# Altium schematic sheet Hardwiring.SchDoc
size 594 x 420 mm; Address1: Address1; Address2: Address2; Address3: Address3; Address4: Address4; DocumentNumber: *Э3; SheetNumber: 10; SheetTotal: 11; DocumentType: Схема электрическая *
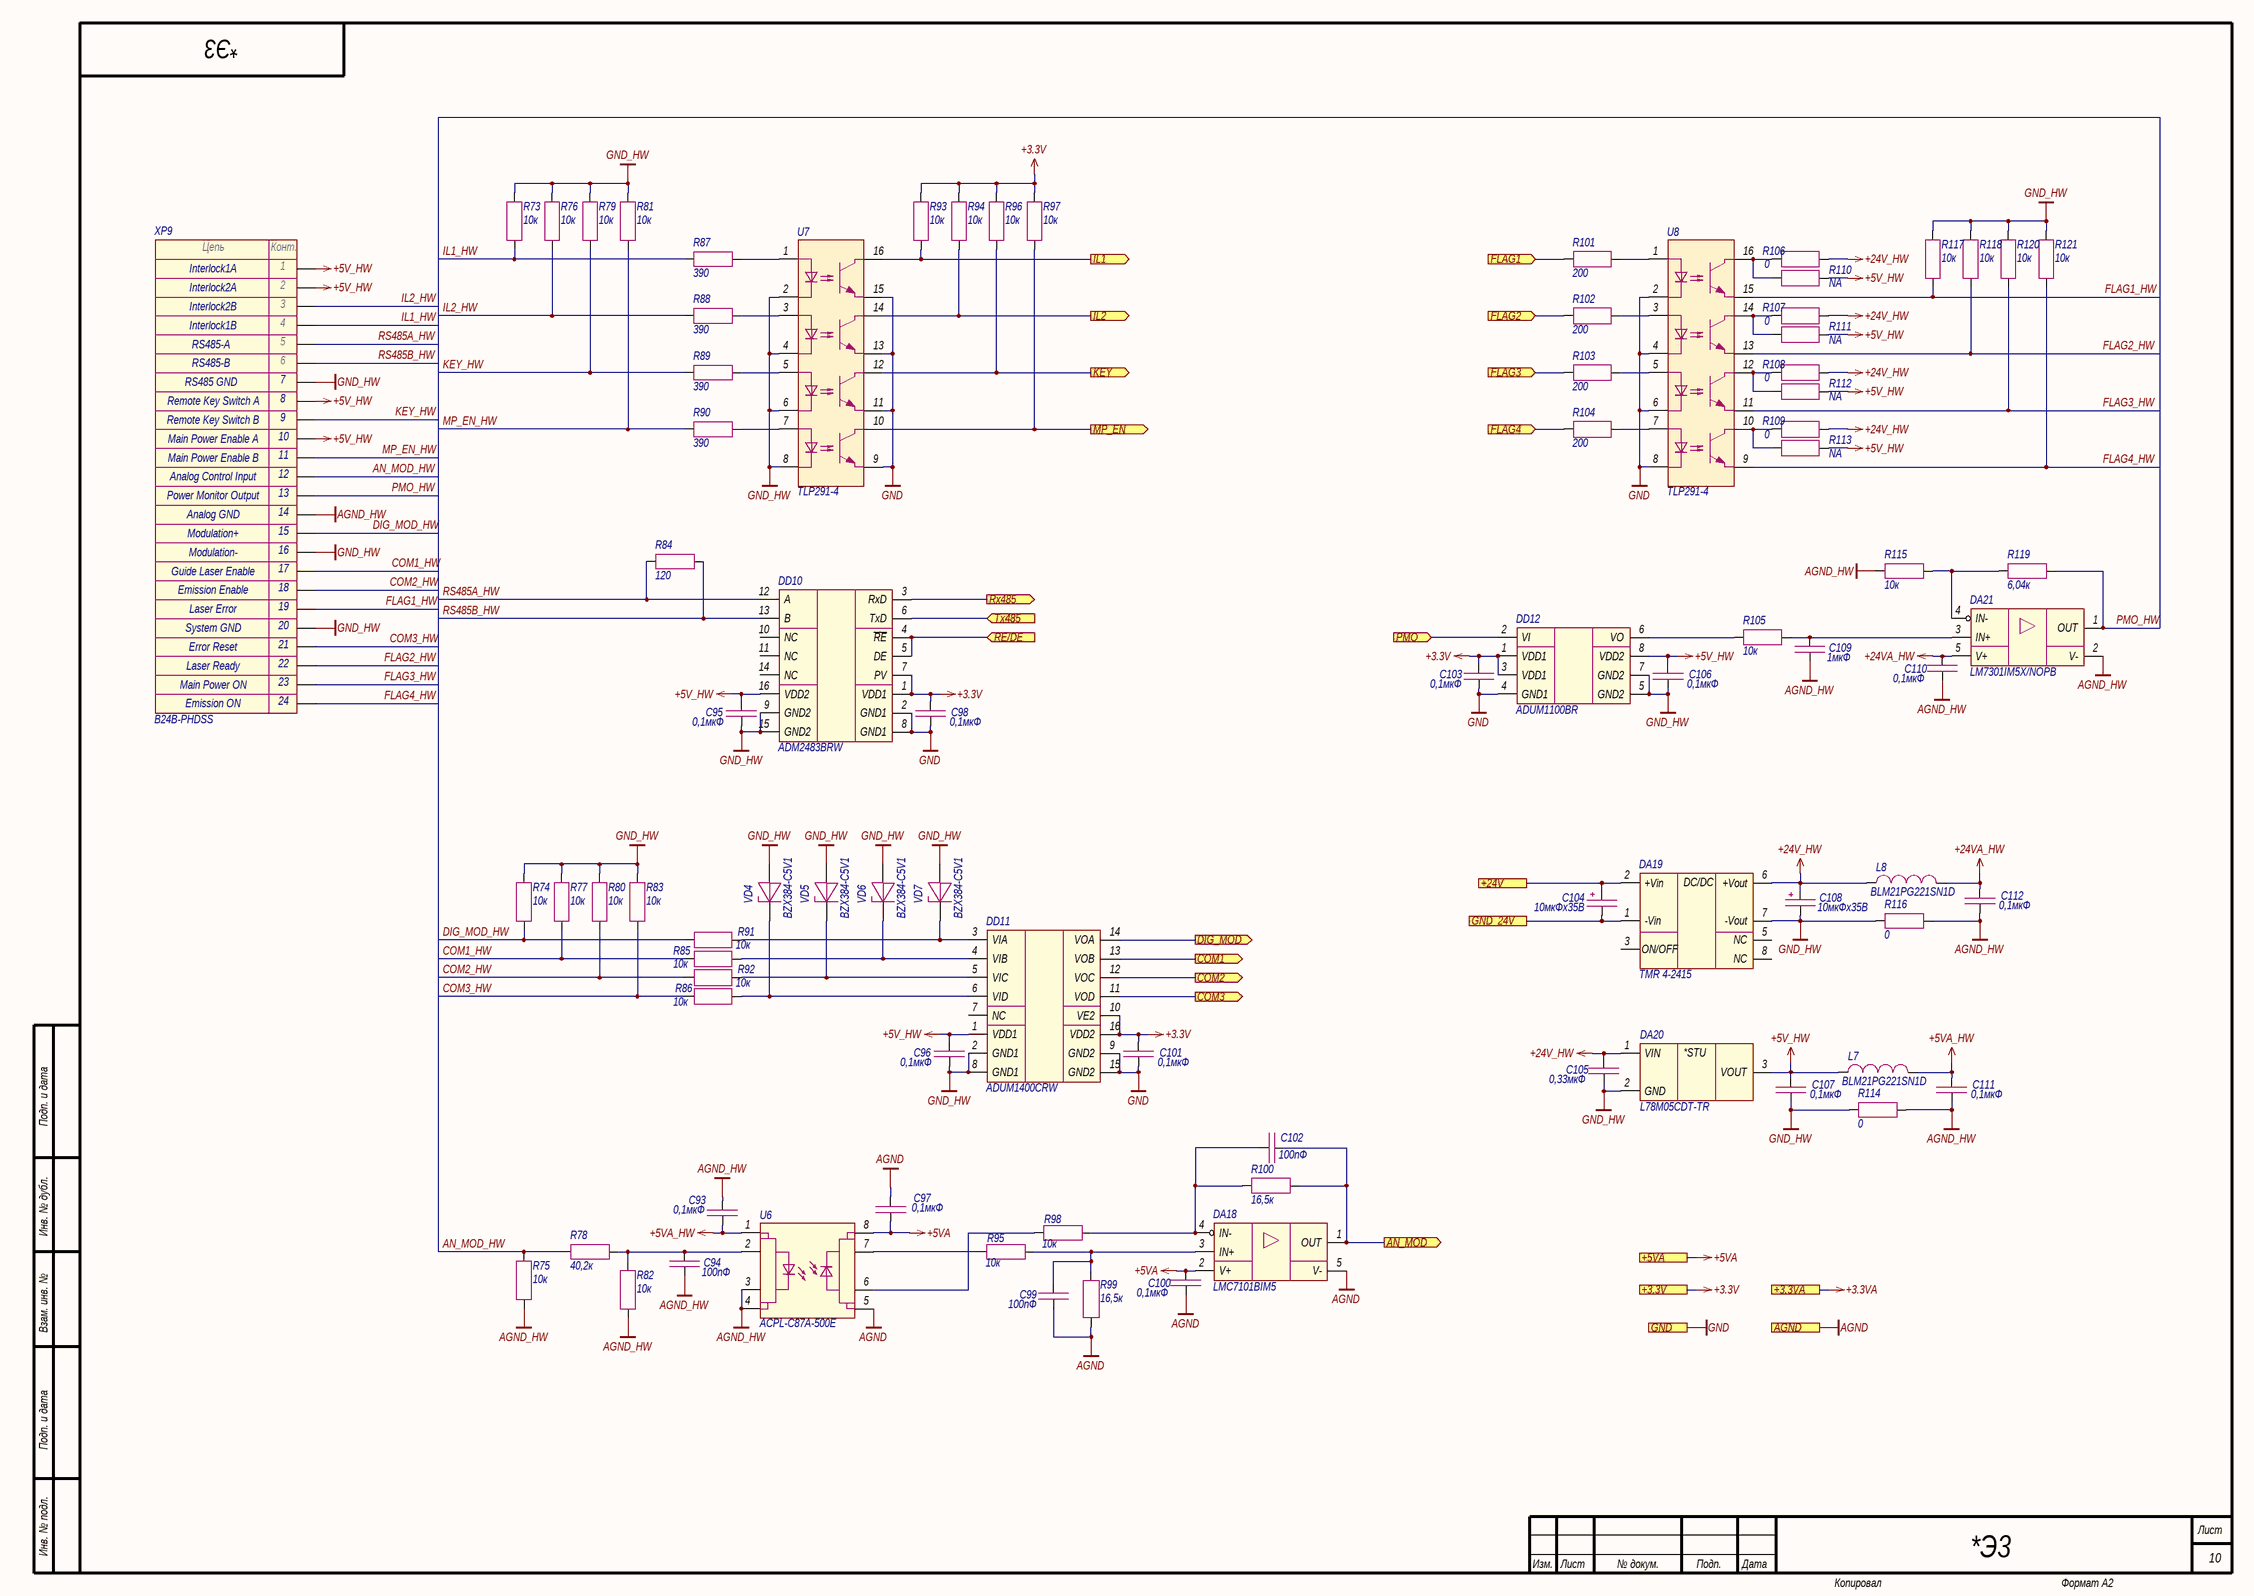
[diagram p0: Hardwiring.SchDoc]

## Parts
C93  0,1мкФ  [CAP_0603]
C94  100пФ  [CAP_0603]
C95  0,1мкФ  [CAP_0603]
C96  0,1мкФ  [CAP_0603]
C97  0,1мкФ  [CAP_0603]
C98  0,1мкФ  [CAP_0603]
C99  100пФ  [CAP_0603]
C100  0,1мкФ  [CAP_0603]
C101  0,1мкФ  [CAP_0603]
C102  100пФ  [CAP_0603]
C103  0,1мкФ  [CAP_0603]
C104  10мкФх35B  [CAP_C]
C105  0,33мкФ  [CAP_0805]
C106  0,1мкФ  [CAP_0603]
C107  0,1мкФ  [CAP_0603]
C108  10мкФх35B  [CAP_C]
C109  1мкФ  [CAP_0603]
C110  0,1мкФ  [CAP_0603]
C111  0,1мкФ  [CAP_0603]
C112  0,1мкФ  [CAP_0603]
DA18  LMC7101BIM5  [SOT-23-5]
DA19  TMR 4-2415  [TMR4 (SIP-8)]
DA20  L78M05CDT-TR  [TO-252]
DA21  LM7301IM5X/NOPB  [SOT-23-5]
DD10  ADM2483BRW  [SOIC-16W]
DD11  ADUM1400CRW  [SOIC-16W]
DD12  ADUM1100BR  [SOIC-8]
L7  BLM21PG221SN1D  [IND_0805]
L8  BLM21PG221SN1D  [IND_0805]
R73  10к  [RES_0603]
R74  10к  [RES_0603]
R75  10к  [RES_0603]
R76  10к  [RES_0603]
R77  10к  [RES_0603]
R78  40,2к  [RES_0603]
R79  10к  [RES_0603]
R80  10к  [RES_0603]
R81  10к  [RES_0603]
R82  10к  [RES_0603]
R83  10к  [RES_0603]
R84  120  [RES_0805]
R85  10к  [RES_0603]
R86  10к  [RES_0603]
R87  390  [RES_0603]
R88  390  [RES_0603]
R89  390  [RES_0603]
R90  390  [RES_0603]
R91  10к  [RES_0603]
R92  10к  [RES_0603]
R93  10к  [RES_0603]
R94  10к  [RES_0603]
R95  10к  [RES_0603]
R96  10к  [RES_0603]
R97  10к  [RES_0603]
R98  10к  [RES_0603]
R99  16,5к  [RES_0603]
R100  16,5к  [RES_0603]
R101  200  [RES_0603]
R102  200  [RES_0603]
R103  200  [RES_0603]
R104  200  [RES_0603]
R105  10к  [RES_0603]
R106  0  [RES_0603]
R107  0  [RES_0603]
R108  0  [RES_0603]
R109  0  [RES_0603]
R110  NA  [RES_0603]
R111  NA  [RES_0603]
R112  NA  [RES_0603]
R113  NA  [RES_0603]
R114  0  [RES_0805]
R115  10к  [RES_0603]
R116  0  [RES_0805]
R117  10к  [RES_0603]
R118  10к  [RES_0603]
R119  6,04к  [RES_0603]
R120  10к  [RES_0603]
R121  10к  [RES_0603]
U6  ACPL-C87A-500E  [SSO-8]
U7  TLP291-4  [SOP-16]
U8  TLP291-4  [SOP-16]
VD4  BZX384-C5V1  [SOD-323]
VD5  BZX384-C5V1  [SOD-323]
VD6  BZX384-C5V1  [SOD-323]
VD7  BZX384-C5V1  [SOD-323]
XP9  B24B-PHDSS  [B24B-PHDSS]

## Ports
+3.3V (see Main[3C], Ethernet[3D], Fiber_interlock[2C], Flow_sensor[2C], LD_driver[1D], Power_supply[1D]), +3.3VA (see Main[3C], LD_driver[1D], Photodiode[1C], Thermistor[2C]), +5VA (see Main[3C], LD_driver[1D], Photodiode[1C]), +24V (see Main[3C], Flow_sensor[2C], Indication[1C], LD_driver[1D], Power_supply[1D]), AGND (see Main[3C], LD_driver[1D], Photodiode[1C], Thermistor[2C]), AN_MOD (out, see Main[2C]), COM1 (out, see Main[2C]), COM2 (out, see Main[2C]), COM3 (out, see Main[2C]), DIG_MOD (out, see Main[2C]), FLAG1 (in, see Main[3B]), FLAG2 (in, see Main[3B]), FLAG3 (in, see Main[3B]), FLAG4 (in, see Main[3C]), GND (see Main[3C], Ethernet[3D], Fiber_interlock[2C], Flow_sensor[2C], Guide_laser[1C], Indication[1C], LD_driver[1D], Power_supply[1D]), GND_24V (see Main[3C], Flow_sensor[2C], Indication[1C], LD_driver[1D], Power_supply[1D]), IL1 (out, see Main[2B]), IL2 (out, see Main[2B]), KEY (out, see Main[2B]), MP_EN (out, see Main[2C]), PMO (in, see Main[3C]), RE/DE (in, see Main[2C]), Rx485 (out, see Main[2C]), Tx485 (in, see Main[2C])

## Nets
+3.3V: C98.1 C101.1 C103.1 DD10.1(VDD1) DD10.7(PV) DD11.10(VE2) DD11.16(VDD2) DD12.1(VDD1) DD12.3(VDD1) R93.1 R94.1 R96.1 R97.1 ; port +3.3V
+3.3VA: port +3.3VA
+5V_HW: C95.1 C96.1 C106.1 C107.1 DA20.3(VOUT) DD10.16(VDD2) DD11.1(VDD1) DD12.8(VDD2) L7.1 R110.2 R111.2 R112.2 R113.2 XP9.1 XP9.2 XP9.8 XP9.10
+5VA: C97.1 C100.1 DA18.2(V+) U6.8(VDD2) ; port +5VA
+5VA_HW: C93.1 C111.1 L7.2 U6.1(VDD1)
+24V_HW: C105.2 C108.1 DA19.6(+Vout) DA20.1(VIN) L8.1 R106.2 R107.2 R108.2 R109.2
+24VA_HW: C110.1 C112.1 DA21.5(V+) L8.2
AGND: C97.2 C99.2 C100.2 DA18.5(V-) R99.2 U6.5(GND2) ; port AGND
AGND_HW: C93.2 C94.1 C109.2 C110.2 C111.2 C112.2 DA21.2(V-) R75.2 R82.2 R114.2 R115.1 R116.2 U6.3(SHDN) U6.4(GND1) XP9.14
GND: C98.2 C101.2 C103.2 DD10.2(GND1) DD10.8(GND1) DD11.9(GND2) DD11.15(GND2) DD12.4(GND1) U7.9 U7.11 U7.13 U7.15 U8.2 U8.4 U8.6 U8.8 ; port GND
GND_HW: C95.2 C96.2 C105.1 C106.2 C107.2 C108.2 DA19.7(-Vout) DA20.2(GND) DD10.9(GND2) DD10.15(GND2) DD11.2(GND1) DD11.8(GND1) DD12.5(GND2) DD12.7(GND2) R73.1 R74.1 R76.1 R77.1 R79.1 R80.1 R81.1 R83.1 R114.1 R116.1 R117.1 R118.1 R120.1 R121.1 U7.2 U7.4 U7.6 U7.8 VD4.2(A) VD5.2(A) VD6.2(A) VD7.2(A) XP9.7 XP9.16 XP9.20
+24V: C104.1 DA19.2(+Vin) ; port +24V
AN_MOD: C102.2 DA18.1(OUT) R100.1 ; port AN_MOD
AN_MOD_HW: R75.1 R78.2 XP9.12
COM1: DD11.13(VOB) ; port COM1
COM1_HW: R77.2 R85.1 XP9.17
COM2: DD11.12(VOC) ; port COM2
COM2_HW: R80.2 R92.1 XP9.18
COM3: DD11.11(VOD) ; port COM3
COM3_HW: R83.2 R86.1 XP9.21
DIG_MOD: DD11.14(VOA) ; port DIG_MOD
DIG_MOD_HW: R74.2 R91.1 XP9.15
FLAG1: R101.2 ; port FLAG1
FLAG1_HW: R117.2 U8.15 XP9.19
FLAG2: R102.2 ; port FLAG2
FLAG2_HW: R118.2 U8.13 XP9.22
FLAG3: R103.2 ; port FLAG3
FLAG3_HW: R120.2 U8.11 XP9.23
FLAG4: R104.2 ; port FLAG4
FLAG4_HW: R121.2 U8.9 XP9.24
GND_24V: C104.2 DA19.1(-Vin) ; port GND_24V
IL1: R93.2 U7.16 ; port IL1
IL1_HW: R73.2 R87.1 XP9.4
IL2: R94.2 U7.14 ; port IL2
IL2_HW: R76.2 R88.1 XP9.3
KEY: R96.2 U7.12 ; port KEY
KEY_HW: R79.2 R89.1 XP9.9
MP_EN: R97.2 U7.10 ; port MP_EN
MP_EN_HW: R81.2 R90.1 XP9.11
PMO: DD12.2(VI) ; port PMO
PMO_HW: DA21.1(OUT) R119.2 XP9.13
RE/DE: DD10.4(~{RE}) DD10.5(DE) ; port RE/DE
RS485A_HW: DD10.12(A) R84.1 XP9.5
RS485B_HW: DD10.13(B) R84.2 XP9.6
Rx485: DD10.3(RxD) ; port Rx485
Tx485: DD10.6(TxD) ; port Tx485
NetC94_2: C94.2 R78.1 R82.1 U6.2(VIN)
NetC99_1: C99.1 DA18.3(IN+) R95.2 R99.1
NetC102_1: C102.1 DA18.4(IN-) R98.2 R100.2
NetC109_1: C109.1 DA21.3(IN+) R105.2
NetDA21_4: DA21.4(IN-) R115.2 R119.1
NetDD11_3: DD11.3(VIA) R91.2 VD7.1(K)
NetDD11_4: DD11.4(VIB) R85.2 VD6.1(K)
NetDD11_5: DD11.5(VIC) R92.2 VD5.1(K)
NetDD11_6: DD11.6(VID) R86.2 VD4.1(K)
NetDD12_6: DD12.6(VO) R105.1
NetR87_2: R87.2 U7.1
NetR88_2: R88.2 U7.3
NetR89_2: R89.2 U7.5
NetR90_2: R90.2 U7.7
NetR95_1: R95.1 U6.7(VOUT+)
NetR98_1: R98.1 U6.6(VOUT-)
NetR101_1: R101.1 U8.1
NetR102_1: R102.1 U8.3
NetR103_1: R103.1 U8.5
NetR104_1: R104.1 U8.7
NetR106_1: R106.1 R110.1 U8.16
NetR107_1: R107.1 R111.1 U8.14
NetR108_1: R108.1 R112.1 U8.12
NetR109_1: R109.1 R113.1 U8.10

Not connected (* = marked no-connect by the designer): DA19 3(ON/OFF) 5(NC) 8(NC); DD10 10(NC) 11(NC) 14(NC); DD11 7(NC)

## Notes on the sheet
- Interlock1A
- Interlock2A
- Interlock2B
- RS485-A
- RS485-B
- Interlock1B
- RS485 GND
- (near XP9) Remote Key Switch A
- (near XP9) Remote Key Switch B
- (near XP9) Main Power Enable A
- (near XP9) Main Power Enable B
- (near XP9) Analog Control Input
- (near XP9) Power Monitor Output
- Analog GND
- Modulation+
- Modulation-
- (near XP9) Guide Laser Enable
- (near XP9) Emission Enable
- System GND
- Error Reset
- Laser Error
- Main Power ON
- Emission ON
- Laser Ready
- Подп. и дата
- Инв. № дубл.
- Взам. инв. №
- Инв. № подл.
- Изм.
- Лист
- № докум.
- Подп.
- Дата
- Копировал
- Формат А2
- (in symbol Connector-24) Цепь; Конт.
- (in symbol L78M) *STU
- (in symbol TMR4) DC/DC

## Library data of the parts
C93 C95-C98 C100 C101 C103 C106 C107 C110-C112 = Capacitor: Manufacturer: Murata; Model: GRM188R71H104KA93D; Value: 0,1мкФ; Document: *
C94 C99 C102 = Capacitor: Manufacturer: Murata; Model: GRM1885C1H101JA01D; Value: 100пФ; Document: *
C104 C108 = Capacitor_Polar: Model: TECAP, 10 мкФ, 35 В, тип C, 10%; Value: 10мкФх35B; Document: *; Manufacturer: *
C105 = Capacitor: Manufacturer: Murata; Model: GRM219R71H334KA88D; Value: 0,33мкФ; Document: *
C109 = Capacitor: Manufacturer: Murata; Model: GRM188R61H105KAALD; Value: 1мкФ; Document: *
DA18 = LMC7101: Manufacturer: Texas Instruments; Model: LMC7101BIM5; Document: *
DA19 = TMR4: Manufacturer: Traco Power; Model: TMR 4-2415; Document: *
DA20 = L78M: Manufacturer: STMicroelectronics; Model: L78M05CDT-TR; Document: *
DA21 = LM7301IM5: Manufacturer: Texas Instruments; Model: LM7301IM5X/NOPB; Document: *
DD10 = ADM2483BRW: Manufacturer: Analog Devices; Model: ADM2483BRW; Document: *
DD11 = ADUM1400: Manufacturer: Analog Devices; Model: ADUM1400CRW; Document: *
DD12 = ADUM1100: Manufacturer: Analog Devices; Model: ADUM1100BR; Document: *
L7 L8 = Inductor: Manufacturer: Murata; Value: *; Model: BLM21PG221SN1D; Document: *
R73-R77 R79-R83 R85 R86 R91-R98 R105 R115 R117 R118 R120 R121 = Resistor: Manufacturer: Yageo; Model: RC0603FR-0710KL; Value: 10к; Document: *
R78 = Resistor: Manufacturer: Yageo; Model: RC0603FR-0740K2L; Value: 40,2к; Document: *
R84 = Resistor: Manufacturer: Yageo; Model: RC0805FR-07120RL; Value: 120; Document: *
R87-R90 = Resistor: Manufacturer: Yageo; Model: RC0603FR-07390RL; Value: 390; Document: *
R99 R100 = Resistor: Manufacturer: Yageo; Model: RC0603FR-0716K5L; Value: 16,5к; Document: *
R101-R104 = Resistor: Manufacturer: Yageo; Model: RC0603FR-07200RL; Value: 200; Document: *
R106-R109 = Resistor: Manufacturer: Yageo; Model: RC0603FR-070RL; Value: 0; Document: *
R110-R113 = Resistor: Value: NA; Model: *; Document: *; Manufacturer: *
R114 R116 = Resistor: Manufacturer: Yageo; Model: RC0805FR-070RL; Value: 0; Document: *
R119 = Resistor: Manufacturer: Yageo; Model: RC0603FR-076K04L; Value: 6,04к; Document: *
U6 = ACPL-C87: Manufacturer: Broadcom; Model: ACPL-C87A-500E
U7 U8 = TLP281-4: Manufacturer: Toshiba; Model: TLP291-4; Document: *
VD4-VD7 = Diode_Zener: Manufacturer: Nexperia; Model: BZX384-C5V1; Document: *
XP9 = Connector-24: Manufacturer: JST; Model: B24B-PHDSS; Document: *